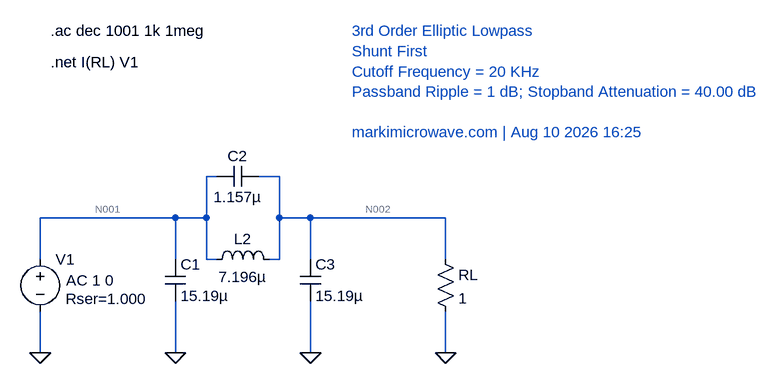
[diagram p0: schematic filter.asc]
filter.asc, the LTspice schematic file:
Version 4.1
SHEET 1 1200 400
WIRE 272 -64 256 -64
WIRE 368 -64 336 -64
WIRE 208 0 0 0
WIRE 256 0 256 -64
WIRE 256 0 208 0
WIRE 368 0 368 -64
WIRE 416 0 368 0
WIRE 624 0 416 0
WIRE 0 64 0 0
WIRE 208 64 208 0
WIRE 256 64 256 0
WIRE 272 64 256 64
WIRE 368 64 368 0
WIRE 368 64 352 64
WIRE 416 64 416 0
WIRE 624 64 624 0
WIRE 0 208 0 144
WIRE 208 208 208 128
WIRE 416 208 416 128
WIRE 624 208 624 144
FLAG 0 208 0
FLAG 208 208 0
FLAG 416 208 0
FLAG 624 208 0
SYMBOL voltage 0 48 R0
WINDOW 123 40 48 Left 2
WINDOW 39 39 77 Left 2
SYMATTR Value2 AC 1 0
SYMATTR SpiceLine Rser=1.000
SYMATTR InstName V1
SYMATTR Value ""
SYMBOL cap 192 64 R0
SYMATTR InstName C1
SYMATTR Value 15.19µ
SYMBOL cap 272 -48 R270
WINDOW 0 32 32 VTop 2
WINDOW 3 0 32 VBottom 2
SYMATTR InstName C2
SYMATTR Value 1.157µ
SYMBOL ind 256 80 R270
WINDOW 0 32 56 VTop 2
WINDOW 3 5 56 VBottom 2
SYMATTR InstName L2
SYMATTR Value 7.196µ
SYMBOL cap 400 64 R0
SYMATTR InstName C3
SYMATTR Value 15.19µ
SYMBOL res 608 48 R0
SYMATTR InstName RL
SYMATTR Value 1
TEXT 16 -288 Left 2 !.ac dec 1001 1k 1meg
TEXT 16 -240 Left 2 !.net I(RL) V1
TEXT 480 -288 Left 2 ;3rd Order Elliptic Lowpass\nShunt First\nCutoff Frequency = 20 KHz\nPassband Ripple = 1 dB; Stopband Attenuation = 40.00 dB\n\nmarkimicrowave.com | Aug 10 2026 16:25

The netlist it stands for:
* filter.asc
V1 N001 0 AC 1 0 Rser=1.000
C1 N001 0 15.19µ
C2 N001 N002 1.157µ
L2 N001 N002 7.196µ
C3 N002 0 15.19µ
RL N002 0 1
.ac dec 1001 1k 1meg
.net I(RL) V1
* 3rd Order Elliptic Lowpass
* Shunt First
* Cutoff Frequency = 20 KHz
* Passband Ripple = 1 dB; Stopband Attenuation = 40.00 dB
* markimicrowave.com | Aug 10 2026 16:25
.backanno
.end

* Results of the author's LTspice run, read from the files saved beside the schematic
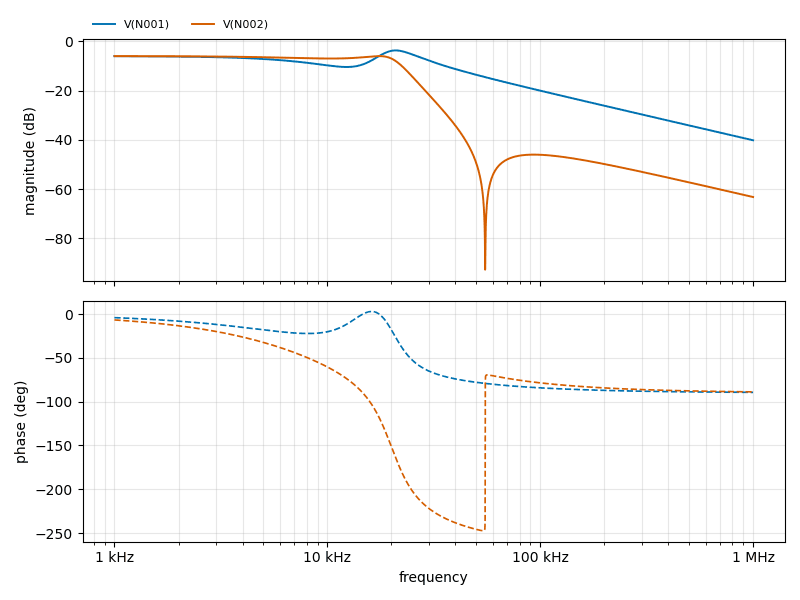
[diagram p1: AC Analysis of filter.asc, plotted from the saved traces]
* AC Analysis, 1 run:
*   V(N001): -6.07 dB at 1 kHz, -40.19 dB at 1 MHz, peak -3.73 dB at 20.93 kHz, 3 dB below the peak at 16.96 kHz and 27.6 kHz
*   V(N002): -6.05 dB at 1 kHz, -63.21 dB at 1 MHz, peak -6.04 dB at 17.53 kHz, 3 dB below the peak at 21.71 kHz